# EAGLE design knowles_mic_v2 (EAGLE 6.5.0)
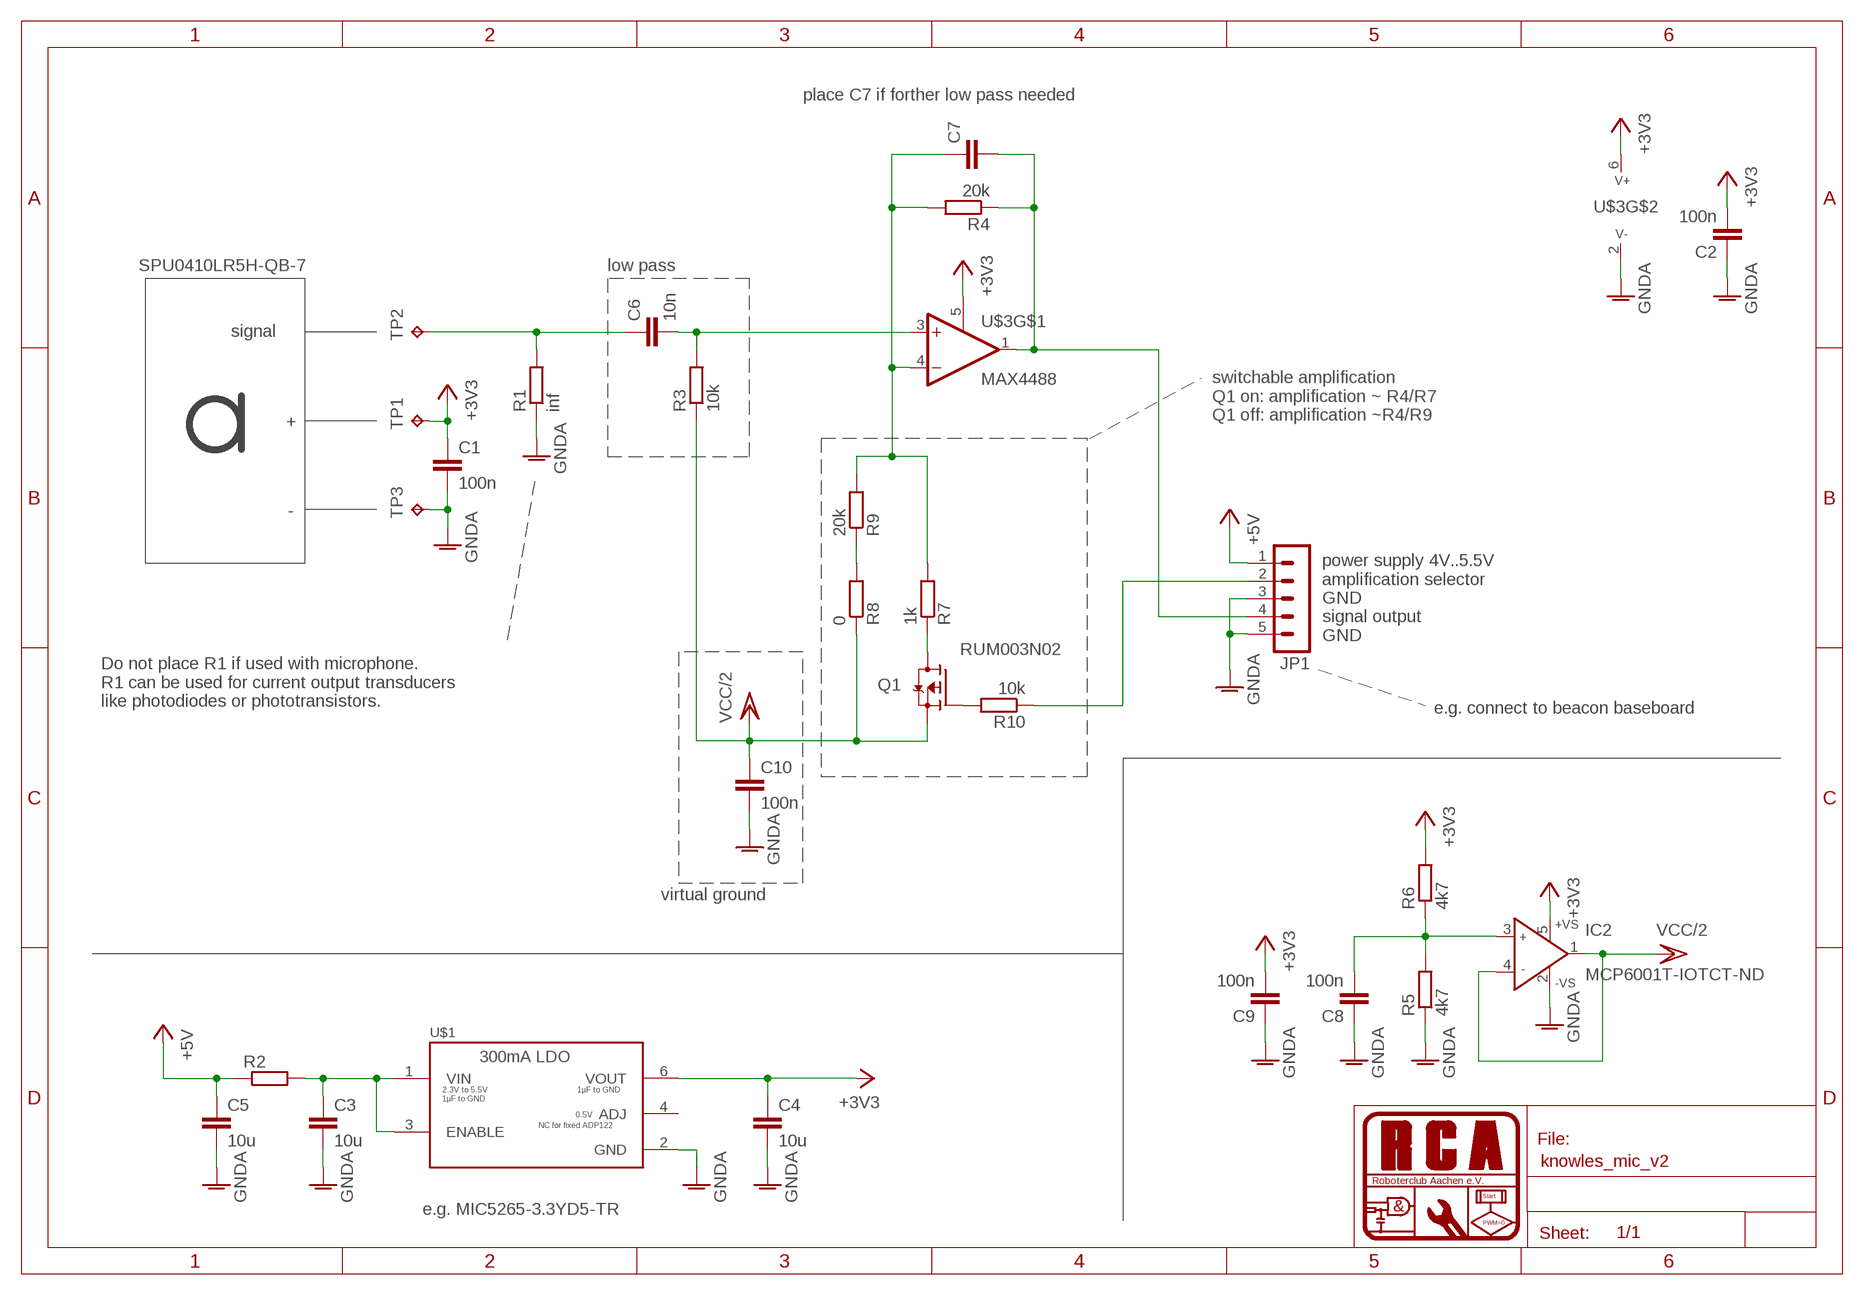
[diagram p0: schematic, sheet 1]

## Parts
C1  100n  C-EUC0603  [C0603]
C2  100n  C-EUC0603  [C0603]
C3  10u  C-EUC0805  [C0805]
C4  10u  C-EUC0805  [C0805]
C5  10u  C-EUC0805  [C0805]
C6  10n  C-EUC0603  [C0603]
C7  C-EUC0603  [C0603]
C8  100n  C-EUC0603  [C0603]
C9  100n  C-EUC0603  [C0603]
C10  100n  C-EUC0603  [C0603]
IC2  MCP6001T-IOTCT-ND  AD8519RJ  [SOT23-5]
JP1  PSS_5G  [22-23-2051]
Q1  RUM003N02  BSA223SP  [SC75_INFINEON]
R1  inf  R-EU_R0603  [R0603]
R2  R-EU_R0603  [R0603]
R3  10k  R-EU_R0603  [R0603]
R4  20k  R-EU_R0603  [R0603]
R5  4k7  R-EU_R0603  [R0603]
R6  4k7  R-EU_R0603  [R0603]
R7  1k  R-EU_R0603  [R0603]
R8  0  R-EU_R0603  [R0603]
R9  20k  R-EU_R0603  [R0603]
R10  10k  R-EU_R0603  [R0603]
TP1  TPTP06R  [TP06R]
TP2  TPTP06R  [TP06R]
TP3  TPTP06R  [TP06R]
U$1  ADP123  [TSOT23-6]
U$3  MAX4488  [TSOT23-6]

## Nets
+3V3: C1.1 C2.2 C4.1 C9.2 IC2.5(+VS) R6.2 TP1.TP U$1.6(VOUT) U$3.5(EN) U$3.6(V+)
+5V: C5.1 JP1.1 R2.1
GNDA: C1.2 C2.1 C3.2 C4.2 C5.2 C8.1 C9.1 C10.2 IC2.2(-VS) JP1.3 JP1.5 R1.1 R5.1 TP3.TP U$1.2(GND) U$3.2(V-)
N$1: C8.2 IC2.3(IN+) R5.2 R6.1
N$3: R8.2 R9.1
N$4: C3.1 R2.2 U$1.1(VIN) U$1.3(ENABLE)
N$5: JP1.2 R10.1
N$9: Q1.1(G) R10.2
N$11: Q1.2(D) R7.1
N$12: C6.1 R1.2 TP2.TP
N$13: C6.2 R3.2 U$3.3(+IN)
N$14: C7.2 JP1.4 R4.1 U$3.1(OUT)
N$17: C7.1 R4.2 R7.2 R9.2 U$3.4(-IN)
VCC/2: C10.1 IC2.1(OUT) IC2.4(IN-) Q1.3(S) R3.1 R8.1
Unconnected: U$1.4(ADJ)

## Notes on the sheet
- place C7 if forther low pass needed
- SPU0410LR5H-QB-7 | low pass
- signal
- switchable amplification
  Q1 on: amplification ~ R4/R7
  Q1 off: amplification ~R4/R9
- +
- -
- power supply 4V..5.5V
  amplification selector
  GND
  signal output
  GND
- Do not place R1 if used with microphone.
  R1 can be used for current output transducers
  like photodiodes or phototransistors.
- e.g. connect to beacon baseboard
- virtual ground
- e.g. MIC5265-3.3YD5-TR

## Library data of the parts
C1-C10 = resistor:C-EU: CAPACITOR, European symbol
IC2 = analog-devices:AD8519: 8 MHz Rail-to-Rail Operational Amplifiers Source: http://www.analog.com/static/imported-files/data_sheets/AD8519_8529.pdf; MF: ALTERA CORPORATION; MPN: AD8519ARTZ-REEL7; OC_FARNELL: 1464960; OC_NEWARK: 59K6794
JP1 = rca_stecker:PSS_5
Q1 = transistor-fet:BSA223SP: OptiMOS(R)-P Small-Signal-Transistor P-Channel, Enhancement mode, Super Logic Level (2.5 V rated) Source: http://www.infineon.com/upload/Document/BSA223SP_Rev1.3.pdf
R1-R10 = resistor:R-EU_: RESISTOR, European symbol
TP1-TP3 = testpad:TP: Test pad
U$1 = rca_ic:ADP123
U$3 = saw:MAX4488

## Board
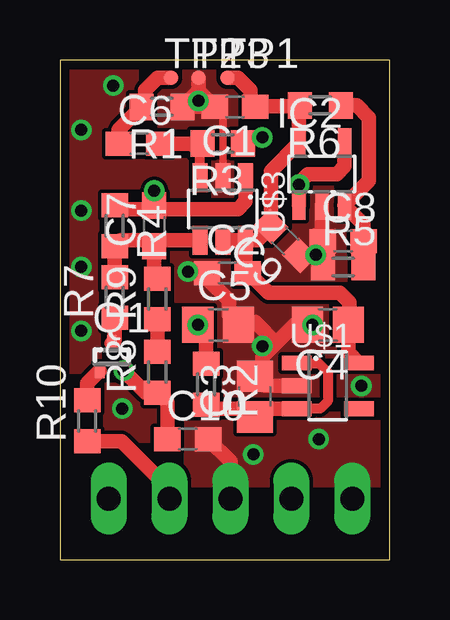
[diagram p1: board, top side]
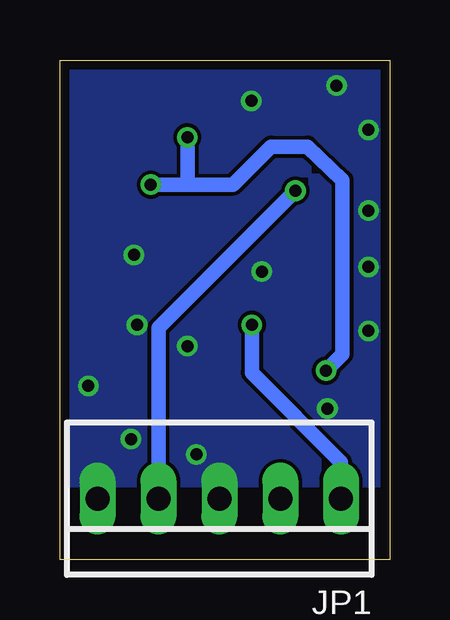
[diagram p2: board, bottom side, seen from below]

Size 13.76 x 20.82 mm. Coordinates in mm from the lower left corner, seen from the top.
Outline: 0,0 13.76,0 13.76,20.82 0,20.82 0,0
Copper layers (1*16): Top 0.0356mm / dielectric 1.5011mm / Bottom 0.0356mm
Design rules "oshPCBOrder": minimum track width 6mil, minimum drill 13mil, track to track 6mil, track to pad 6mil, pad to pad 6mil, via to via 6mil, smd to smd 6mil, copper to edge 15mil, drill to drill 6mil, minimum pad ring 7mil, minimum via ring 7mil, stop-mask expansion 3mil, vias tented up to drill 0mil, thermal gap 10mil

### Footprints (pad centres in the part's own frame; a part is rotated, then mirrored left to right if it is on the bottom)
C0603 = smd 1.1 x 1: 1 -0.85,0; 2 0.85,0
C0805 = smd 1.3 x 1.5: 1 -0.85,0; 2 0.85,0
SOT23-5 = smd 0.55 x 1.2: 1 -0.95,-1.3; 2 0,-1.3; 3 0.95,-1.3; 4 0.95,1.3; 5 -0.95,1.3
22-23-2051 = drill 1 long: 1 -5.08,0; 2 -2.54,0; 3 0,0; 4 2.54,0; 5 5.08,0
SC75_INFINEON = smd 0.4 x 0.65: 1 -0.5,-0.575; 2 0,0.575; 3 0.5,-0.575
R0603 = smd 1 x 1.1: 1 -0.85,0; 2 0.85,0
TP06R = smd 0.6 x 0.6: TP 0,0
TSOT23-6 = smd 0.62 x 1.22: 1 -0.95,-1.3; 2 0,-1.3; 3 0.95,-1.3; 4 0.95,1.3; 6 -0.95,1.3
TSOT23-6' = smd 0.62 x 1.22: 1 -0.95,-1.3; 2 0,-1.3; 3 0.95,-1.3; 4 0.95,1.3; 5 0,1.3; 6 -0.95,1.3

### Placement (x,y rotation side)
C1  7.3,18.86 180 top
C2  6.99,11.94 0 top
C3  8.13,6.79 90 top
C4  11.18,9.78 180 top
C5  6.6,9.78 0 top
C6  3.3,17.34 0 top
C7  3.94,13.91 90 top
C8  11.81,13.27 0 top
C9  9.4,13.27 135 top
C10  5.33,5.02 0 top
IC2  10.92,16.07 0 top
JP1  7.11,2.54 180 bottom
Q1  2.16,8.45 0 top
R1  4.25,18.86 180 top
R2  6.1,7.3 270 top
R3  6.79,17.34 180 top
R4  2.29,13.91 270 top
R5  11.81,12.19 0 top
R6  10.86,18.92 180 top
R7  2.29,10.92 90 top
R8  4.06,7.81 90 top
R9  4.06,10.86 90 top
R10  1.14,5.78 90 top
TP1  6.99,20.07 0 top
TP2  4.64,20.07 0 top
TP3  5.78,20.07 0 top
U$1  11.18,7.24 270 top
U$3  MAX4488  [TSOT23-6']  6.79,14.61 180 top

### Tracks (layer width: path | path; a pad name or v marks a point on that pad's centre or on a via)
+3V3
  Top 0.61: U$1.6 12.03,8.64 C4.1 12.06,9.82 12.06,10.73 11.68,11.11 8.7,11.11 7.94,11.87 C2.2 7.75,12.03 U$3.6 | TP1.TP 7.43,20.07 7.94,19.56 7.94,19.07 C1.1 8.18,18.89 9.97,18.89 | 9.97,18.89 IC2.5 8.8,16.19 C9.2 8.23,13.3 7.81,13.3 U$3.6 | 9.97,18.89 R6.2 | U$3.6 U$3.5
+5V  (via drill 0.5)
  Top 0.61: R2.1 6.1,9.61 C5.1
  Bottom 0.61: JP1.1 2.03,4.06 5.75,7.79 C5.1
  other vias: 5.75,9.78
GNDA  (via drill 0.5)
  Top 0.305: U$3.2 6.79,18.86 C1.2
  Top 0.61: U$1.2 8.53,7.24 C3.2 8.45,7.96 8.45,8.45 9.02,9.02 | 9.02,9.02 9.78,9.78 C4.2 v10.54,9.78 | 9.02,9.02 8.13,9.91 C5.2 7.05,10.18 7.05,10.79 6.13,11.71 C2.1 5.4,11.94 v5.33,12 | IC2.2 10.92,13.4 | 10.92,13.4 10.92,12.7 | 10.92,12.7 10.92,12.29 R5.1 | 10.92,13.4 10.96,13.36 C8.1 10.71,13.53 | R1.1 6.35,18.86 | R1.1 5.78,19.53 | TP3.TP 5.78,19.53 | 5.78,19.53 C1.2 | JP1.3 7.11,4.09 C10.2 | C9.1 10.89,12.67 10.92,12.7 | v10.67,12.7 10.92,12.7 | R1.1 5.52,18.86 v5.78,19.11
  other vias: 2.6,6.29 0.89,9.53 0.89,12.19 0.89,14.54 0.89,17.91 2.22,19.75 8.45,8.89 8.06,4.38 10.79,5.02 12.57,7.24
  pour Bottom (no thermals): 0,21.59 13.97,21.59 13.91,3.3 -0.06,3.3
  pour Top (no thermals): -0.06,21.08 13.91,21.08 13.91,3.3 -0.06,3.3
N$1
  Top 0.61: R5.2 C8.2 12.66,13.98 IC2.3 | IC2.3 | R6.1 12.38,18.92 12.89,18.41 12.89,15.78 IC2.3
N$3
  Top 0.61: R9.1 R8.2
N$4
  Top 0.406: U$1.1 10.8,8.19 11.18,7.81 11.18,6.6 10.86,6.29 U$1.3
  Top 0.61: U$1.3 8.47,6.29 C3.1 7.79,6.29 6.26,6.29 R2.2
N$5
  Top 0.61: R10.1 2.56,4.93 4.57,2.92 JP1.2
N$9
  Top 0.61: R10.2 1.14,7.35 Q1.1
N$11
  Top 0.61: R7.1 2.29,9.15 Q1.2
N$12
  Top 0.61: TP2.TP 4.06,20.07 3.56,19.56 3.56,19.01 R1.2 2.45,17.91 C6.1
N$13
  Top 0.406: U$3.3 5.84,17.34 R3.2
  Top 0.61: C6.2 R3.2 5.46,17.3
N$14  (via drill 0.5)
  Top 0.61: 3.81,14.61 7.43,14.61 7.75,14.92 U$3.1 | 3.81,14.61 2.44,14.61 R4.1 | 3.81,14.61 3.94,14.73 C7.2 v3.94,15.37
  Bottom 0.61: JP1.4 9.65,9.65 v3.94,15.37
N$17
  Top 0.61: 4.19,13.3 C7.1 | C7.1 3.94,11.84 R9.2 | U$3.4 3.94,13.3 | 3.94,13.3 2.53,13.3 R4.2 R7.2 | C7.1 3.94,13.3
VCC/2  (via drill 0.5)
  Top 0.61: IC2.4 11.87,16.38 11.56,16.07 10.35,16.07 9.97,15.69 IC2.1 v9.97,15.62 | Q1.3 3.57,6.96 R8.1 4.48,6.54 C10.1 | R3.1 7.64,17.59 v8.45,17.59
  Bottom 0.61: v9.97,15.62 8.64,15.62 8.45,15.62 | 8.45,15.62 6.54,15.62 4.95,17.21 3.43,17.21 1.97,15.81 1.97,8.56 Q1.3 | v8.45,17.59 8.45,15.62
  other vias: 2.66,7.87